# EAGLE design StandalonePRG (EAGLE 7.6.0)
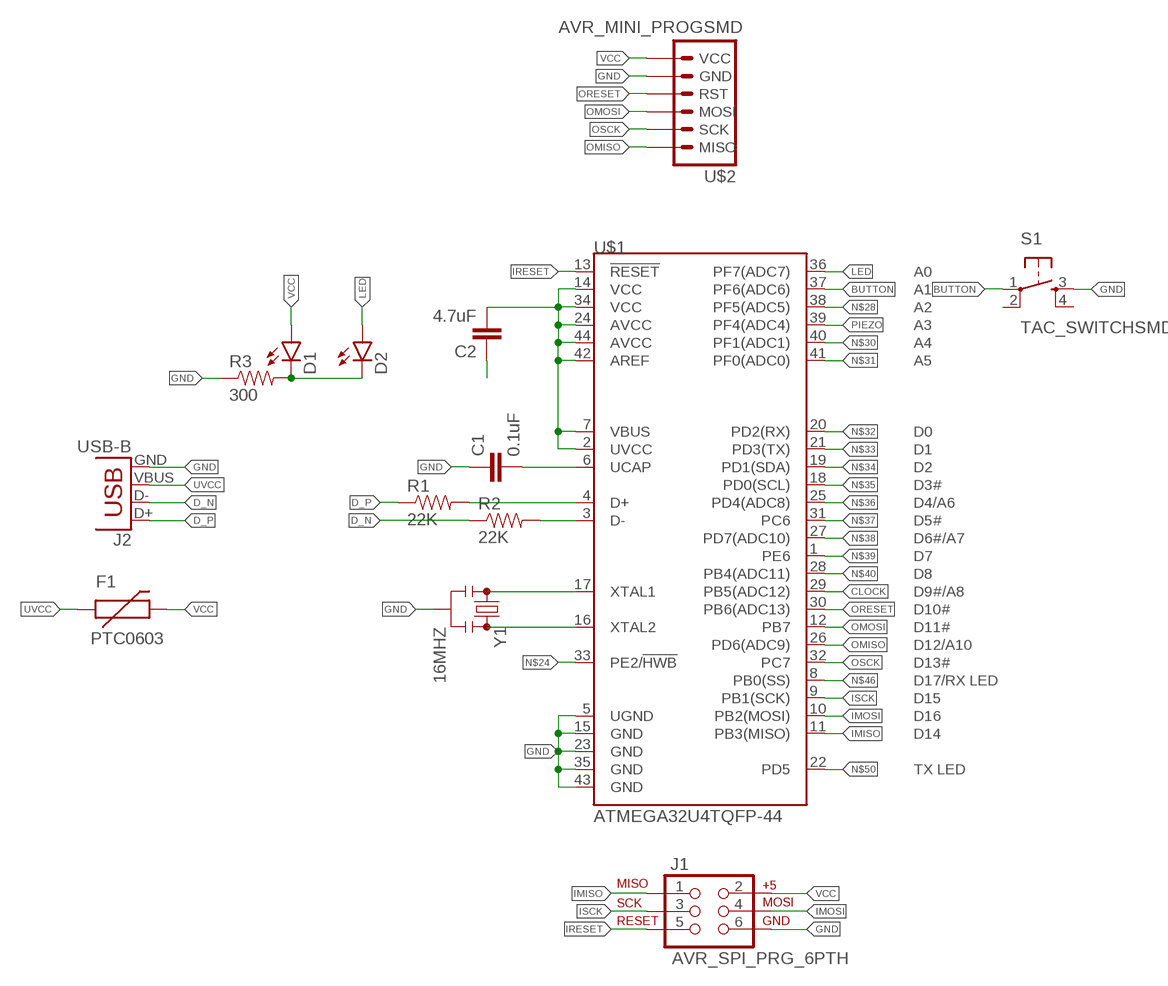
[diagram p0: schematic, sheet 1]

## Parts
C1  0.1uF  0.1UF-100V-10%(0603)  [0603-CAP]
C2  4.7uF  4.7UF-6.3V-10%(0603)0603  [0603-CAP]
D1  LED0603  [LED-0603]
D2  LED0603  [LED-0603]
F1  PTC0603  [0603]
J1  AVR_SPI_PRG_6PTH  [2X3]
J2  USB-B  USBPTH  [USB-B-PTH]
R1  22K  22KOHM1/10W1%(0603)  [0603-RES]
R2  22K  22KOHM1/10W1%(0603)  [0603-RES]
R3  300  300OHM-1/10W-1%(0603)  [0603-RES]
S1  TAC_SWITCHSMD  [TACTILE-SWITCH-SMD]
U$1  ATMEGA32U4TQFP-44  [TQFP44]
U$2  AVR_MINI_PROGSMD  [AVR_MINI_PROG]
Y1  16MHZ  RESONATOR16MHZ  [RESONATOR-SMD]

## Nets
BUTTON: S1.1 U$1.37(PF6(ADC6))
CLOCK: U$1.29(PB5(ADC12))
D_N: J2.D- R2.1
D_P: J2.D+ R1.1
DR_N: R2.2 U$1.3(D-)
DR_P: R1.2 U$1.4(D+)
GND: C1.1 C2.1 J1.6 J2.GND R3.1 S1.3 U$1.5(UGND) U$1.15(GND) U$1.23(GND) U$1.35(GND) U$1.43(GND) U$2.2(GND) Y1.2
IMISO: J1.1 U$1.11(PB3(MISO))
IMOSI: J1.4 U$1.10(PB2(MOSI))
IRESET: J1.5 U$1.13(!RESET)
ISCK: J1.3 U$1.9(PB1(SCK))
LED: D2.A U$1.36(PF7(ADC7))
LGND: D1.C D2.C R3.2
N$22: U$1.17(XTAL1) Y1.1
N$23: U$1.16(XTAL2) Y1.3
N$24: U$1.33(PE2/!HWB)
N$28: U$1.38(PF5(ADC5))
N$30: U$1.40(PF1(ADC1))
N$31: U$1.41(PF0(ADC0))
N$32: U$1.20(PD2(RX))
N$33: U$1.21(PD3(TX))
N$34: U$1.19(PD1(SDA))
N$35: U$1.18(PD0(SCL))
N$36: U$1.25(PD4(ADC8))
N$37: U$1.31(PC6)
N$38: U$1.27(PD7(ADC10))
N$39: U$1.1(PE6)
N$40: U$1.28(PB4(ADC11))
N$46: U$1.8(PB0(SS))
N$50: U$1.22(PD5)
OMISO: U$1.26(PD6(ADC9)) U$2.6(MISO)
OMOSI: U$1.12(PB7) U$2.4(MOSI)
ORESET: U$1.30(PB6(ADC13)) U$2.3(RST)
OSCK: U$1.32(PC7) U$2.5(SCK)
PIEZO: U$1.39(PF4(ADC4))
UCAP: C1.2 U$1.6(UCAP)
UVCC: F1.1 J2.VBUS
VCC: C2.2 D1.A F1.2 J1.2 U$1.2(UVCC) U$1.7(VBUS) U$1.14(VCC) U$1.24(AVCC) U$1.34(VCC) U$1.42(AREF) U$1.44(AVCC) U$2.1(VCC)
Unconnected: S1.2 S1.4

## Library data of the parts
C1 = SparkFun-Capacitors:0.1UF-100V-10%(0603): CAP-08390; PROD_ID: CAP-08390
C2 = SparkFun-Capacitors:4.7UF-6.3V-10%(0603): CAP-08280; PROD_ID: CAP-08280
D1 D2 = SparkFun-LED:LED: LEDs Standard schematic elements and footprints for 5mm, 3mm, 1206, and 0603 sized LEDs. 5mm - Spark Fun Electronics SKU : COM-00529 (and others)
F1 = SparkFun-PowerIC:PTC: Resettable Fuse PTC Resettable Fuse. Spark Fun Electronics SKU : COM-08357
J1 = SparkFun-Connectors:AVR_SPI_PRG_6: AVR ISP 6 Pin This is the reduced ISP connector for AVR programming. Common on Arduino. This footprint will take up less PCB space and can be used with a 10-pin to 6-pin adapter such as SKU: BOB-08508 **Special note about "TEST_POINT" package. The stop mask is on the top side, so if you want your programming test points to be on the bottom of your board, make sure to place this package on the bottom side of the board. This also ensure that the orientation to program from the bottom side will be correct.
J2 = SparkFun-Connectors:USB: USB Connectors USB-B-PTH is fully proven SKU : PRT-00139/CONN-08278 USB-miniB is fully proven SKU : PRT-00587 USB-A-PCB is untested. USB-A-H is throughly reviewed, but untested. Spark Fun Electronics SKU : PRT-00437 USB-B-SMT is throughly reviewed, but untested. Needs silkscreen touching up. USB-A-S has not been used/tested USB-MB-H has not been used/tested USB-MICROB has been used. CONN-09505; PROD_ID: CONN-08278
R1 R2 = SparkFun-Resistors:22KOHM1/10W1%(0603): RES-07853; PROD_ID: RES-07853
R3 = SparkFun-Resistors:300OHM-1/10W-1%(0603): RES-10328; PROD_ID: RES_10328
S1 = SparkFun-Retired:TAC_SWITCH: Momentary Switch Button commonly used for reset or general input. Spark Fun Electronics SKU : COM-00097 SMT- SWCH-08247; PROD_ID: SWCH-08247
U$1 = SparkFun-DigitalIC:ATMEGA32U4: Atmel 44-pin 8-bit Microcontroller with 32KBytes of ISP Flash and USB Controller
U$2 = SparkFun-Connectors:AVR_MINI_PROG: AVR ISP 6-pin inline header
Y1 = SparkFun-FreqCtrl:RESONATOR: Resonator Small SMD resonator. Used, eg, on the Arduino Pro/ Pro Mini boards. 8MHz- XTAL-08895 16MHz- XTAL-08900; PROD_ID: XTAL-08900

## Board
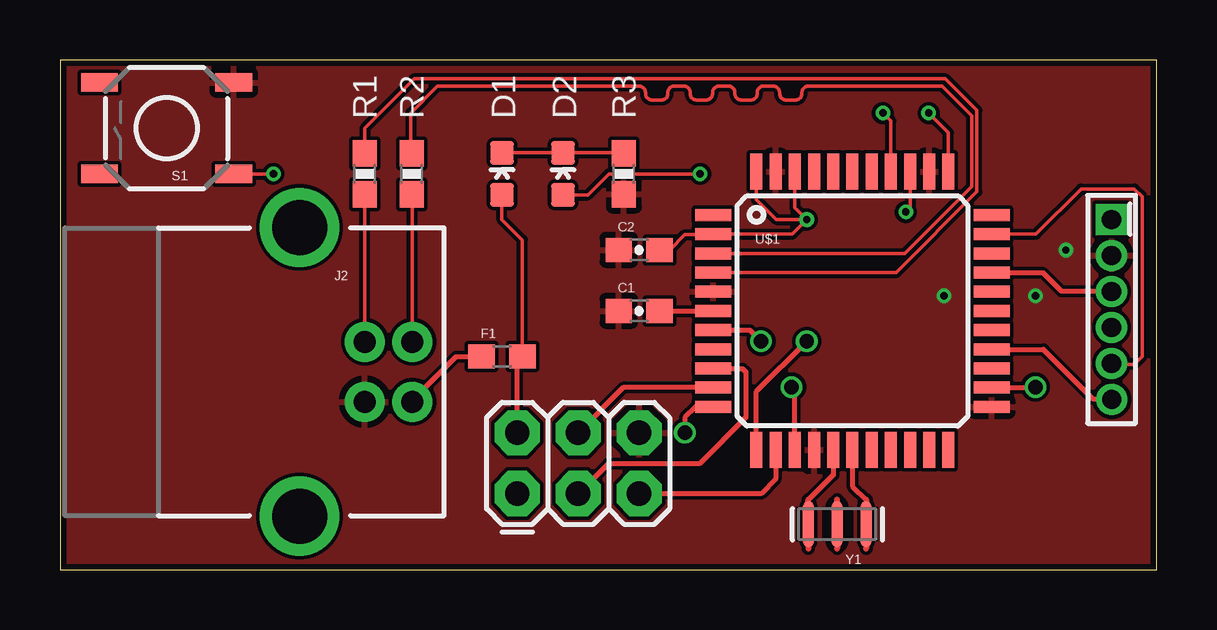
[diagram p1: board, top side]
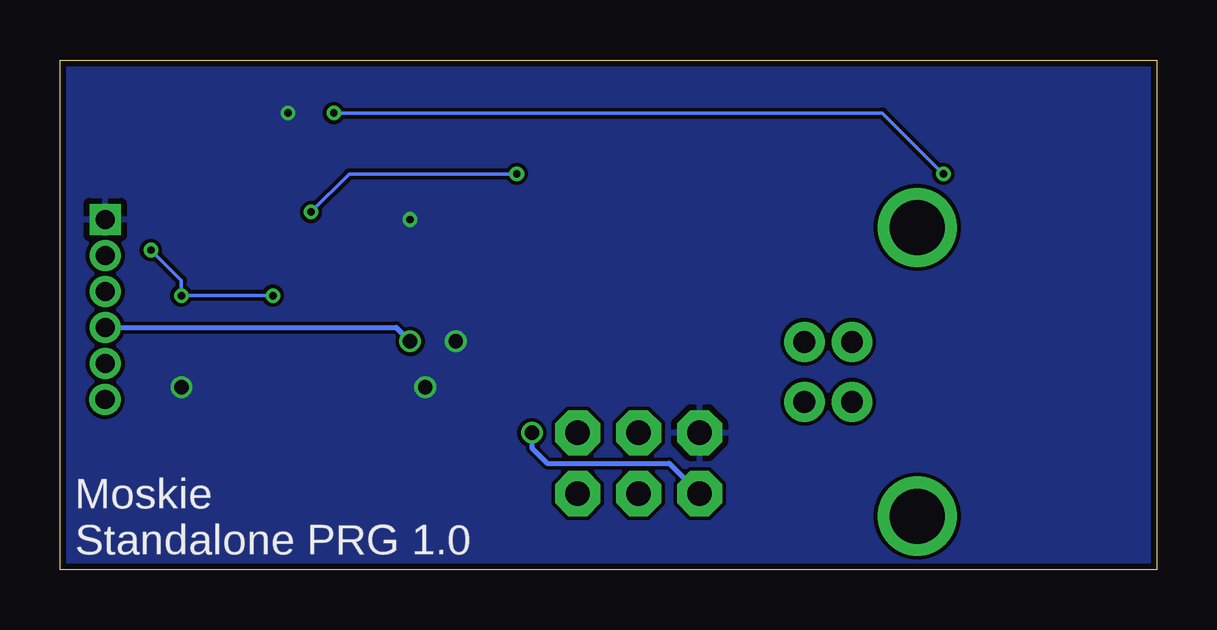
[diagram p2: board, bottom side, seen from below]

Size 45.7 x 21.26 mm. Coordinates in mm from the lower left corner, seen from the top.
Outline: 0,0 45.7,0 45.7,21.26 0,21.26 0,0
Copper layers (1*16): Top 0.035mm / dielectric 1.5mm / Bottom 0.035mm
Design rules "Seeed-2Layer": minimum track width 6mil, minimum drill 12mil, track to track 6mil, track to pad 6mil, pad to pad 6mil, via to via 6mil, smd to smd 0mil, copper to edge 10mil, drill to drill 10mil, minimum pad ring 10mil, minimum via ring 6mil, stop-mask expansion 2mil, vias tented up to drill 100mil, thermal gap 10mil

### Footprints (pad centres in the part's own frame; a part is rotated, then mirrored left to right if it is on the bottom)
0603-CAP = smd 1.1 x 1: 1 -0.85,0; 2 0.85,0
LED-0603 = smd 1 x 1: A 0,-0.877; C 0,0.877
0603 = smd 1.1 x 1: 1 -0.85,0; 2 0.85,0
2X3 = drill 1.016 pad 1.88 octagon: 1 0,0; 2 0,2.54; 3 2.54,0; 4 2.54,2.54; 5 5.08,0; 6 5.08,2.54
USB-B-PTH = drill 0.914 pad 1.676: D+ 0,1.25; D- 1.981,1.25; GND 0,-1.25; VBUS 1.981,-1.25 | drill 2.286: S1 -2.718,-6.02; S2 -2.718,6.02
0603-RES = smd 1.1 x 1: 1 -0.85,0; 2 0.85,0
TACTILE-SWITCH-SMD = smd 1.524 x 0.762: 1 -2.794,1.905; 2 2.794,1.905; 3 -2.794,-1.905; 4 2.794,-1.905
TQFP44 = smd 1.5 x 0.5: 1 -5.8,4; 2 -5.8,3.2; 3 -5.8,2.4; 4 -5.8,1.6; 5 -5.8,0.8; 6 -5.8,0; 7 -5.8,-0.8; 8 -5.8,-1.6; 9 -5.8,-2.4; 10 -5.8,-3.2; 11 -5.8,-4; 23 5.8,-4; 24 5.8,-3.2; 25 5.8,-2.4; 26 5.8,-1.6; 27 5.8,-0.8; 28 5.8,0; 29 5.8,0.8; 30 5.8,1.6; 31 5.8,2.4; 32 5.8,3.2; 33 5.8,4 | smd 0.5 x 1.5: 12 -4,-5.8; 13 -3.2,-5.8; 14 -2.4,-5.8; 15 -1.6,-5.8; 16 -0.8,-5.8; 17 0,-5.8; 18 0.8,-5.8; 19 1.6,-5.8; 20 2.4,-5.8; 21 3.2,-5.8; 22 4,-5.8; 34 4,5.8; 35 3.2,5.8; 36 2.4,5.8; 37 1.6,5.8; 38 0.8,5.8; 39 0,5.8; 40 -0.8,5.8; 41 -1.6,5.8; 42 -2.4,5.8; 43 -3.2,5.8; 44 -4,5.8
AVR_MINI_PROG = drill 0.8 pad 1.27 square: 1 0,0 | drill 0.8 pad 1.27: 2 1.5,0; 3 3,0; 4 4.5,0; 5 6,0; 6 7.5,0.01
RESONATOR-SMD = smd 0.45 x 1.905: 1 -1.2,0; 2 0,0; 3 1.2,0

### Placement (x,y rotation side)
C1  24.13,10.79 0 top
C2  24.13,13.34 0 top
D1  18.41,16.51 0 top
D2  20.95,16.51 0 top
F1  18.41,8.89 0 top
J1  19.05,3.17 0 top
J2  12.7,8.26 0 top
R1  12.7,16.51 90 top
R2  14.66,16.51 90 top
R3  23.5,16.51 90 top
S1  4.45,18.41 180 top
U$1  33.02,10.79 0 top
U$2  43.81,14.61 270 top
Y1  32.38,1.91 180 top

### Tracks (layer width: path | path; a pad name or v marks a point on that pad's centre or on a via)
BUTTON  (via drill 0.3)
  Top 0.152: S1.1 v8.89,16.51 | U$1.37 34.62,18.72 v34.29,19.05
  Bottom 0.152: v34.29,19.05 11.43,19.05 v8.89,16.51
D_N
  Top 0.152: J2.D- 14.68,15.63 R2.1
D_P
  Top 0.152: J2.D+ R1.1
DR_N
  Top 0.152: U$1.3 35.2,13.2 37.99,15.98 37.99,18.94 36.77,20.17 31.18,20.17 arc90 30.91,19.9 30.91,19.86 arc-90 30.65,19.59 30.25,19.59 arc-90 29.98,19.86 29.98,19.9 arc90 29.71,20.17 29.32,20.17 arc90 29.05,19.9 29.05,19.86 arc-90 28.79,19.59 28.39,19.59 arc-90 28.12,19.86 28.12,19.9 arc90 27.85,20.17 27.46,20.17 arc90 27.19,19.9 27.19,19.86 arc-90 26.92,19.59 26.52,19.59 arc-90 26.26,19.86 26.26,19.9 arc90 25.99,20.17 25.59,20.17 arc90 25.33,19.9 25.33,19.86 arc-90 25.06,19.59 24.66,19.59 arc-90 24.4,19.86 24.4,19.9 arc90 24.13,20.17 15.72,20.17 14.61,19.05 14.61,17.41 R2.2
DR_P
  Top 0.152: U$1.4 34.84,12.39 38.21,15.77 38.21,19.16 36.89,20.47 14.76,20.47 12.7,18.41 R1.2
GND  (via drill 0.3)
  Bottom 0.152: v36.83,11.43 v40.64,11.43 40.64,12.06 v41.91,13.34
  pour Top: 0,21.59 45.72,21.59 45.72,0 0,0
IMISO  (via drill 0.6)
  Top 0.203: U$1.11 26.48,6.79 26.04,6.35 v26.04,5.71
  Bottom 0.203: v26.04,5.71 26.04,5.08 25.4,4.45 20.32,4.45 J1.1
IMOSI
  Top 0.203: U$1.10 23.47,7.59 J1.4
IRESET
  Top 0.203: U$1.13 29.82,3.79 29.21,3.17 J1.5
ISCK
  Top 0.203: J1.3 22.86,4.45 26.67,4.45 28.57,6.35 28.57,8.26 28.43,8.39 U$1.9
LED  (via drill 0.3)
  Top 0.152: D2.A 21.98,15.63 22.86,16.51 v26.67,16.51 | U$1.36 35.42,15.1 v35.24,14.92
  Bottom 0.152: v26.67,16.51 33.66,16.51 v35.24,14.92
LGND
  Top 0.152: D1.C D2.C 23.47,17.39 R3.2
N$22
  Top 0.203: U$1.17 33.02,3.49 33.59,2.92
N$23
  Top 0.203: U$1.16 32.22,3.96 31.18,2.92
OMISO
  Top 0.203: U$1.26 40.97,9.2 43.06,7.11 U$2.6
OMOSI  (via drill 0.6)
  Top 0.203: U$1.12 29.02,7.43 v31.11,9.53
  Bottom 0.203: U$2.4 31.7,10.11 v31.11,9.53
ORESET
  Top 0.203: U$1.30 40.95,12.39 41.73,11.61 U$2.3
OSCK
  Top 0.152: U$1.32 40.66,13.99 42.55,15.88 44.77,15.88 45.09,15.56 45.09,8.89 44.77,8.57 43.85,8.57 U$2.5
UCAP
  Top 0.203: C1.2 U$1.6
UVCC
  Top 0.203: J2.VBUS 14.68,7.06 16.51,8.89 F1.1
VCC  (via drill 0.3, 0.6)
  Top 0.152: U$1.34 37.02,18.23 v36.2,19.05 | U$1.42 30.62,15.1 v31.11,14.61 | U$1.44 29.02,15.43 29.84,14.61 v31.11,14.61 | v31.11,14.61 30.5,13.99 U$1.2 27.2,13.97 26.04,13.97 25.4,13.34 C2.2 | F1.2 19.27,13.76 18.41,14.61 D1.A
  Top 0.203: J1.2 19.05,8.68 F1.2 | U$1.7 28.74,9.99 v29.21,9.53 | U$1.14 30.62,7.48 v30.48,7.62 | U$1.24 40.62,7.59 v40.64,7.62
  pour Bottom: 0,21.59 46.99,21.59 46.99,0 0,0

### Text on the board
bPlace: Moskie / Standalone PRG 1.0